# EAGLE schematic Open_Sesame_circuitboard (EAGLE 9.6.2)
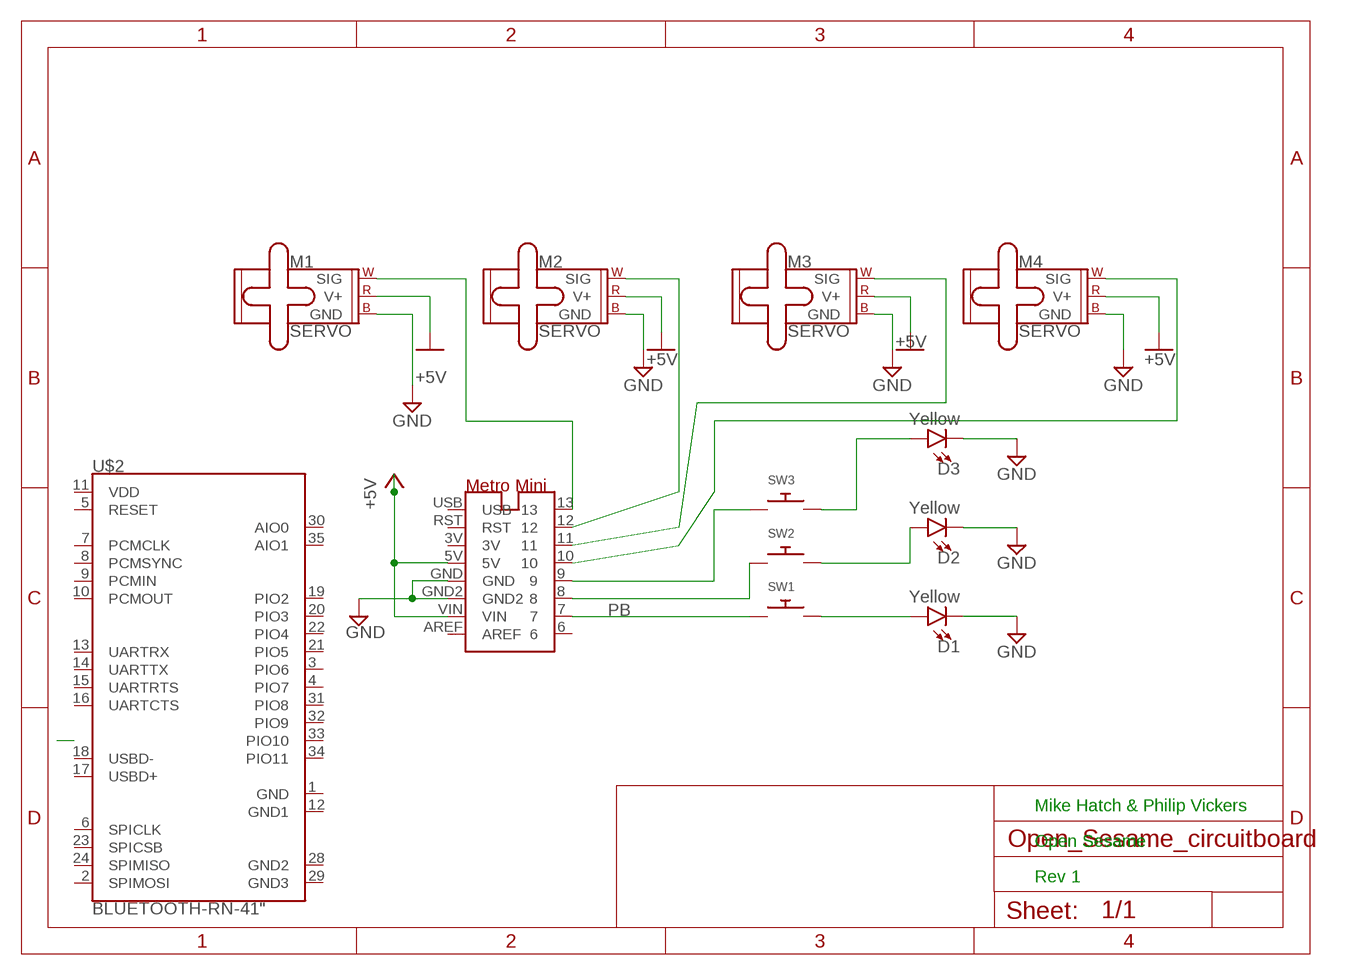
[diagram p0: schematic, sheet 1]

## Parts
D1  Yellow  LED-YELLOW0603  [LED-0603]
D2  Yellow  LED-YELLOW0603  [LED-0603]
D3  Yellow  LED-YELLOW0603  [LED-0603]
M1  SERVO  [1X03]
M2  SERVO  [1X03]
M3  SERVO  [1X03]
M4  SERVO  [1X03]
SW1  SWITCH_PUSHBUTTONC&K_KSS  [BTN_CK_KSS]
SW2  SWITCH_PUSHBUTTONC&K_KSS  [BTN_CK_KSS]
SW3  SWITCH_PUSHBUTTONC&K_KSS  [BTN_CK_KSS]
U$1  VTC_LIB_METROMINISHIELD  [VTC_LIB_METROMINISHEILD]
U$2  BLUETOOTH-RN-41"  [RN41]

## Nets
+5V: M1.2(V+) M2.2(V+) M3.2(V+) M4.2(V+) U$1.5V U$1.VIN
GND: D1.C D2.C D3.C M1.3(GND) M2.3(GND) M3.3(GND) M4.3(GND) U$1.GND U$1.GND2
N$1: M1.1(SIG) U$1.13
N$2: M2.1(SIG) U$1.12
N$3: D1.A SW1.P$2
N$4: SW2.P$1 U$1.8
N$5: D2.A SW2.P$2
N$6: SW3.P$1 U$1.9
N$7: D3.A SW3.P$2
N$8: M3.1(SIG) U$1.11
N$9: M4.1(SIG) U$1.10
PB: SW1.P$1 U$1.7
Unconnected: U$1.3V U$1.6 U$1.AREF U$1.RST U$1.USB U$2.1(GND) U$2.2(SPIMOSI) U$2.3(PIO6) U$2.4(PIO7) U$2.5(RESET) U$2.6(SPICLK) U$2.7(PCMCLK) U$2.8(PCMSYNC) U$2.9(PCMIN) U$2.10(PCMOUT) U$2.11(VDD) U$2.12(GND1) U$2.13(UARTRX) U$2.14(UARTTX) U$2.15(UARTRTS) U$2.16(UARTCTS) U$2.17(USBD+) U$2.18(USBD-) U$2.19(PIO2) U$2.20(PIO3) U$2.21(PIO5) U$2.22(PIO4) U$2.23(SPICSB) U$2.24(SPIMISO) U$2.28(GND2) U$2.29(GND3) U$2.30(AIO0) U$2.31(PIO8) U$2.32(PIO9) U$2.33(PIO10) U$2.34(PIO11) U$2.35(AIO1)

## Notes on the sheet
- Mike Hatch & Philip Vickers
- Open Sesame
- Rev 1

## Library data of the parts
D1-D3 = SparkFun-LED:LED-YELLOW: Yellow SMD LED Used in manufacturing several products at SparkFun. Packages: 0603 - SMD 0603 package[Product Link] <http://www.kingbrightusa.com/product.asp?catalog_name=LED&product_id=APT1608SYCK> 0603 -SMART - SMART SMD 0603 package (more efficient/more expensive) [Product Link] <http://www.osram-os.com/osram_os/en/products/product-catalog/led-light-emitting-diodes/smartled-0603/ly-l29k/index.jsp> LilyPad - SMD1206 package[Product Datasheet] <https://www.sparkfun.com/datasheets/DevTools/LilyPad/Q150YUS4.pdf> SparkFun Products: Blynk Board <https://www.sparkfun.com/products/13794> IOIO-OTG <https://www.sparkfun.com/products/13613> XBee Explorer Serial <https://www.sparkfun.com/products/13225>; PROD_ID: DIO-09003
M1-M4 = SparkFun-Electromechanical:SERVO: Servo Motor 3-pin connector for a standard servo motor (voltage supply, ground, and control signal.) SparkFun Products Servo - Generic (Sub-Micro Size) <https://www.sparkfun.com/products/9065> (ROB-09065) Servo - Generic High Torque Continuous Rotation (Standard Size) <https://www.sparkfun.com/products/9347> (ROB-09347) Servo - Generic High Torque (Standard Size) <https://www.sparkfun.com/products/11965> (ROB-11965)
SW1-SW3 = adafruit:SWITCH_PUSHBUTTON: Buttons SOFTTOUCHSMD_SJ - Soft touch temporary push button (Super Junk Akihabara) Compatible with SKPMANE010 [Mouser: 688-SKPMAN] C&K_KSS = Digikey: KSS221GLFS
U$1 = VTC_LIB:VTC_LIB_METROMINISHIELD
U$2 = SparkFun-RF:BLUETOOTH-RN-41: Roving Networks RN-41 Bluetooth Module The RN-41 module is a small form factor, low power, class 1 Bluetooth radio that is ideal for designers who want to add wireless capability to their products without spending significant time and money developing Bluetooth-specific hardware and software. The RN-41 supports multiple interface protocols, is simple to design in, and is fully certified, making it a complete embedded Bluetooth solution. SparkFun Products: Bluetooth SMD Module - RN-41 <https://www.sparkfun.com/products/12575> (WRL-12575) Bluetooth Module Breakout - Roving Networks (RN-41 v6.15) <https://www.sparkfun.com/products/12579> (WRL-12579); PROD_ID: IC-11844; SF_ID: WRL-12575